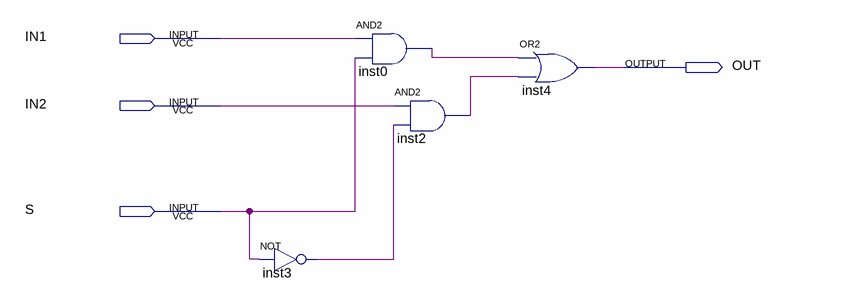
[diagram p0: schematic sheet]
// Quartus schematic sdProjectDemuxSinal.bdf as structural Verilog: 4 symbols, 4 pins
module sdProjectDemuxSinal (
  input  IN1,
  input  IN2,
  input  S,
  output OUT
);

  wire inst0_out, inst2_out, inst3_out;

  not inst3 (inst3_out, S);
  and inst0 (inst0_out, IN1, S);
  and inst2 (inst2_out, IN2, inst3_out);
  or inst4 (OUT, inst0_out, inst2_out);
endmodule
